# EAGLE design atum-breakout (EAGLE 6.5.0)
AUTHOR: Brad Campbell; REV: A; TITLE: Atum Breakout
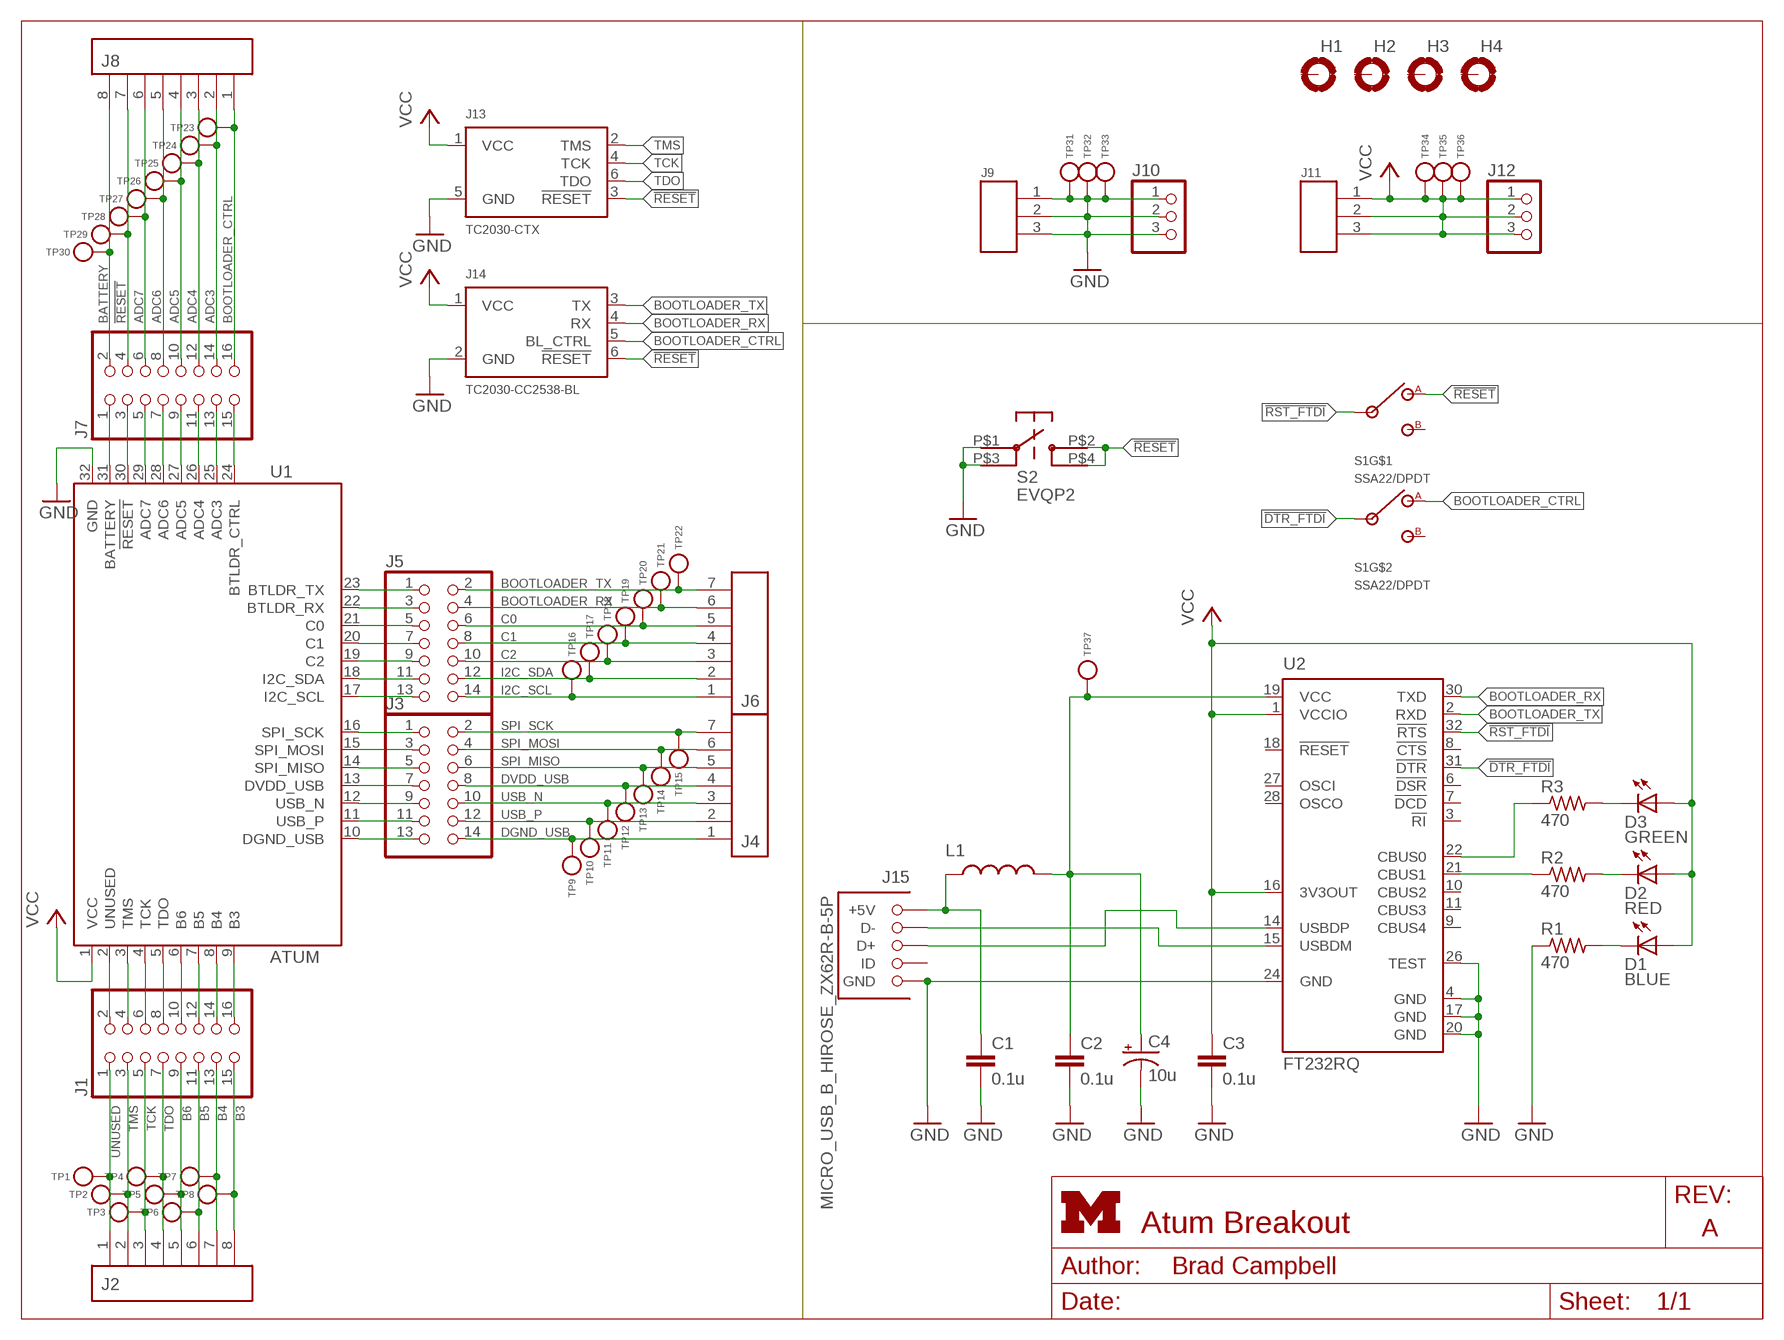
[diagram p0: schematic, sheet 1]
FRAME1 (LETTER_L): HEIGHT: 8.5in; WIDTH: 11in

## Parts
C1  0.1u  C-EUC0603  [C0603]
C2  0.1u  C-EUC0603  [C0603]
C3  0.1u  C-EUC0603  [C0603]
C4  10u  CAP_POL1206  [EIA3216]
D1  BLUE  LED0603  [LED-0603]
D2  RED  LED0603  [LED-0603]
D3  GREEN  LED0603  [LED-0603]
H1  MOUNT-PAD-ROUND3.2  [3,2-PAD]
H2  MOUNT-PAD-ROUND3.2  [3,2-PAD]
H3  MOUNT-PAD-ROUND3.2  [3,2-PAD]
H4  MOUNT-PAD-ROUND3.2  [3,2-PAD]
J1  PINHD-2X8  [2X08]
J2  SCREW-TERMINAL_8_0.100  [CONN_BLOCK_8]
J3  PINHD-2X7  [2X07]
J4  SCREW-TERMINAL_7_0.100  [CONN_BLOCK_7]
J5  PINHD-2X7  [2X07]
J6  SCREW-TERMINAL_7_0.100  [CONN_BLOCK_7]
J7  PINHD-2X8  [2X08]
J8  SCREW-TERMINAL_8_0.100  [CONN_BLOCK_8]
J9  SCREW-TERMINAL_3_0.100  [CONN_BLOCK_3]
J10  PINHD-1X3  [1X03]
J11  SCREW-TERMINAL_3_0.100  [CONN_BLOCK_3]
J12  PINHD-1X3  [1X03]
J13  TC2030-CTX  [TC2030-IDC]
J14  TC2030-CC2538-BL  [TC2030-IDC]
J15  MICRO_USB_B_HIROSE_ZX62R-B-5P  [USB_MICRO_B-HIROSE-ZX62R-B-5P]
L1  INDUCTOR0603  [0603]
R1  470  R-US_R0603  [R0603]
R2  470  R-US_R0603  [R0603]
R3  470  R-US_R0603  [R0603]
S1  SSA22/DPDT  [SSA22/DPDT]
S2  EVQP2  [EVQP2]
TP1  TEST_POINT_0.040IN  [TESTPOINT_0.040IN]
TP2  TEST_POINT_0.040IN  [TESTPOINT_0.040IN]
TP3  TEST_POINT_0.040IN  [TESTPOINT_0.040IN]
TP4  TEST_POINT_0.040IN  [TESTPOINT_0.040IN]
TP5  TEST_POINT_0.040IN  [TESTPOINT_0.040IN]
TP6  TEST_POINT_0.040IN  [TESTPOINT_0.040IN]
TP7  TEST_POINT_0.040IN  [TESTPOINT_0.040IN]
TP8  TEST_POINT_0.040IN  [TESTPOINT_0.040IN]
TP9  TEST_POINT_0.040IN  [TESTPOINT_0.040IN]
TP10  TEST_POINT_0.040IN  [TESTPOINT_0.040IN]
TP11  TEST_POINT_0.040IN  [TESTPOINT_0.040IN]
TP12  TEST_POINT_0.040IN  [TESTPOINT_0.040IN]
TP13  TEST_POINT_0.040IN  [TESTPOINT_0.040IN]
TP14  TEST_POINT_0.040IN  [TESTPOINT_0.040IN]
TP15  TEST_POINT_0.040IN  [TESTPOINT_0.040IN]
TP16  TEST_POINT_0.040IN  [TESTPOINT_0.040IN]
TP17  TEST_POINT_0.040IN  [TESTPOINT_0.040IN]
TP18  TEST_POINT_0.040IN  [TESTPOINT_0.040IN]
TP19  TEST_POINT_0.040IN  [TESTPOINT_0.040IN]
TP20  TEST_POINT_0.040IN  [TESTPOINT_0.040IN]
TP21  TEST_POINT_0.040IN  [TESTPOINT_0.040IN]
TP22  TEST_POINT_0.040IN  [TESTPOINT_0.040IN]
TP23  TEST_POINT_0.040IN  [TESTPOINT_0.040IN]
TP24  TEST_POINT_0.040IN  [TESTPOINT_0.040IN]
TP25  TEST_POINT_0.040IN  [TESTPOINT_0.040IN]
TP26  TEST_POINT_0.040IN  [TESTPOINT_0.040IN]
TP27  TEST_POINT_0.040IN  [TESTPOINT_0.040IN]
TP28  TEST_POINT_0.040IN  [TESTPOINT_0.040IN]
TP29  TEST_POINT_0.040IN  [TESTPOINT_0.040IN]
TP30  TEST_POINT_0.040IN  [TESTPOINT_0.040IN]
TP31  TEST_POINT_0.040IN  [TESTPOINT_0.040IN]
TP32  TEST_POINT_0.040IN  [TESTPOINT_0.040IN]
TP33  TEST_POINT_0.040IN  [TESTPOINT_0.040IN]
TP34  TEST_POINT_0.040IN  [TESTPOINT_0.040IN]
TP35  TEST_POINT_0.040IN  [TESTPOINT_0.040IN]
TP36  TEST_POINT_0.040IN  [TESTPOINT_0.040IN]
TP37  TEST_POINT_0.040IN  [TESTPOINT_0.040IN]
U1  ATUM  [ATUM]
U2  FT232RQ  [QFN32]

## Nets
!DTR_FTDI: S1.COM2 U2.31(!DTR)
!RESET: J7.3 J7.4 J8.7 J13.3(!RESET) J14.6(!RESET) S1.A1 S2.P$2 S2.P$4 TP29.TESTPOINT U1.30(!RESET)
!RST_FTDI: S1.COM1 U2.32(!RTS)
ADC3: J7.13 J7.14 J8.2 TP24.TESTPOINT U1.25(ADC3)
ADC4: J7.11 J7.12 J8.3 TP25.TESTPOINT U1.26(ADC4)
ADC5: J7.9 J7.10 J8.4 TP26.TESTPOINT U1.27(ADC5)
ADC6: J7.7 J7.8 J8.5 TP27.TESTPOINT U1.28(ADC6)
ADC7: J7.5 J7.6 J8.6 TP28.TESTPOINT U1.29(ADC7)
B3: J1.15 J1.16 J2.8 TP8.TESTPOINT U1.9(B3)
B4: J1.13 J1.14 J2.7 TP7.TESTPOINT U1.8(B4)
B5: J1.11 J1.12 J2.6 TP6.TESTPOINT U1.7(B5)
B6: J1.9 J1.10 J2.5 TP5.TESTPOINT U1.6(B6)
BATTERY: J7.1 J7.2 J8.8 TP30.TESTPOINT U1.31(BATTERY)
BOOTLOADER_CTRL: J7.15 J7.16 J8.1 J14.5(BL_CTRL) S1.A2 TP23.TESTPOINT U1.24(BTLDR_CTRL)
BOOTLOADER_RX: J5.3 J5.4 J6.6 J14.4(RX) TP21.TESTPOINT U1.22(BTLDR_RX) U2.30(TXD)
BOOTLOADER_TX: J5.1 J5.2 J6.7 J14.3(TX) TP22.TESTPOINT U1.23(BTLDR_TX) U2.2(RXD)
C0: J5.5 J5.6 J6.5 TP20.TESTPOINT U1.21(C0)
C1: J5.7 J5.8 J6.4 TP19.TESTPOINT U1.20(C1)
C2: J5.9 J5.10 J6.3 TP18.TESTPOINT U1.19(C2)
DGND_USB: J3.13 J3.14 J4.1 TP9.TESTPOINT U1.10(DGND_USB)
DVDD_USB: J3.7 J3.8 J4.4 TP12.TESTPOINT U1.13(DVDD_USB)
GND: C1.2 C2.2 C3.2 C4.C(-) J9.1 J9.2 J9.3 J10.1 J10.2 J10.3 J13.5(GND) J14.2(GND) J15.5(GND) R1.1 S2.P$1 S2.P$3 TP31.TESTPOINT TP32.TESTPOINT TP33.TESTPOINT U1.32(GND) U2.4(GND) U2.17(GND) U2.20(GND) U2.24(GND) U2.26(TEST)
I2C_SCL: J5.13 J5.14 J6.1 TP16.TESTPOINT U1.17(I2C_SCL)
I2C_SDA: J5.11 J5.12 J6.2 TP17.TESTPOINT U1.18(I2C_SDA)
N$1: R3.1 U2.22(CBUS0)
N$2: D2.C R2.2
N$3: J15.2(D-) U2.15(USBDM)
N$4: J15.3(D+) U2.14(USBDP)
N$5: R2.1 U2.21(CBUS1)
N$6: C2.1 C4.A(+) L1.2 TP37.TESTPOINT U2.19(VCC)
N$7: D3.C R3.2
N$8: D1.C R1.2
SPI_MISO: J3.5 J3.6 J4.5 TP13.TESTPOINT U1.14(SPI_MISO)
SPI_MOSI: J3.3 J3.4 J4.6 TP14.TESTPOINT U1.15(SPI_MOSI)
SPI_SCK: J3.1 J3.2 J4.7 TP15.TESTPOINT U1.16(SPI_SCK)
TCK: J1.5 J1.6 J2.3 J13.4(TCK) TP3.TESTPOINT U1.4(TCK)
TDO: J1.7 J1.8 J2.4 J13.6(TDO) TP4.TESTPOINT U1.5(TDO)
TMS: J1.3 J1.4 J2.2 J13.2(TMS) TP2.TESTPOINT U1.3(TMS)
UNUSED: J1.1 J1.2 J2.1 TP1.TESTPOINT U1.2(UNUSED)
USB5V: C1.1 J15.1(+5V) L1.1
USB_N: J3.9 J3.10 J4.3 TP11.TESTPOINT U1.12(USB_N)
USB_P: J3.11 J3.12 J4.2 TP10.TESTPOINT U1.11(USB_P)
VCC: C3.1 D1.A D2.A D3.A J11.1 J11.2 J11.3 J12.1 J12.2 J12.3 J13.1(VCC) J14.1(VCC) TP34.TESTPOINT TP35.TESTPOINT TP36.TESTPOINT U1.1(VCC) U2.1(VCCIO) U2.16(3V3OUT)
Unconnected: H1.B3,2(MOUNT) H2.B3,2(MOUNT) H3.B3,2(MOUNT) H4.B3,2(MOUNT) J15.4(ID) S1.B1 S1.B2 U2.3(!RI) U2.6(!DSR) U2.7(!DCD) U2.8(!CTS) U2.9(CBUS4) U2.10(CBUS2) U2.11(CBUS3) U2.18(!RESET) U2.27(OSCI) U2.28(OSCO)

## Library data of the parts
C1-C3 = rcl:C-EU: CAPACITOR, European symbol; DIGIKEY: 445-1316-1-ND
C4 = SparkFun:CAP_POL: Capacitor Polarized These are standard SMD and PTH capacitors. Normally 10uF, 47uF, and 100uF in electrolytic and tantalum varieties. Always verify the external diameter of the through hole cap, it varies with capacity, voltage, and manufacturer. The EIA devices should be standard.; DIGIKEY: 478-1655-1-ND
D1-D3 = SparkFun:LED: LEDs Standard schematic elements and footprints for 5mm, 3mm, 1206, and 0603 sized LEDs. 5mm - Spark Fun Electronics SKU : COM-00529 (and others)
H1-H4 = holes:MOUNT-PAD-ROUND: MOUNTING PAD, round
J1 J7 = pinhead:PINHD-2X8: PIN HEADER; DIGIKEY: 609-3364-ND; MOUSER: 649-68602-116HLF; NEWARK: 20M2833
J2 J8 = headers:SCREW-TERMINAL_8_0.100: 8x 0.100 in screw terminal block; DIGIKEY: 277-1279-ND
J3 J5 = pinhead:PINHD-2X7: PIN HEADER; DIGIKEY: 609-3491-ND; MOUSER: 649-67996-114HLF; NEWARK: 30M1973
J4 J6 = headers:SCREW-TERMINAL_7_0.100: 7x 0.100 in screw terminal block; DIGIKEY: 277-1278-ND
J9 J11 = headers:SCREW-TERMINAL_3_0.100: 3x 0.100 in screw terminal block; DIGIKEY: 277-1274-ND
J10 J12 = pinhead:PINHD-1X3: PIN HEADER
J13 = connector:TC2030-CTX: Tag Connect footprint for ARM JTAG. 10 pin ARM Cortex Debug Connector.
J14 = connector:TC2030-CC2538-BL: Tag connect programmer for the CC2538 bootloader. The RX/TX switch happens on the programmer board, so when using this connect the TX pin to the TX pin on the CC2538 and same for the RX.
J15 = connector:MICRO_USB_B_HIROSE_ZX62R-B-5P: USB Micro B Connector Rounded side is up.; DIGIKEY: H11574CT-ND; MOUSER: 798-ZX62R-B-5P; NEWARK: 69W0714
L1 = SparkFun:INDUCTOR: Inductors Basic Inductor/Choke - 0603 and 1206. Footprints are not proven and vary greatly between part numbers.; DIGIKEY: 240-2373-1-ND
R1-R3 = rcl:R-US_: RESISTOR, American symbol
S1 = switches:SSA22/DPDT: SW SLIDE DPDT 2POS SSA SER 30V; DIGIKEY: 450-1604-ND; MOUSER: 506-SSA22; NEWARK: 50F5561
S2 = berkeley-epic:EVQP2; DIGIKEY: P11084SCT-ND; MOUSER: 667-EVQ-P2K02Q
TP1-TP37 = headers:TEST_POINT_0.040IN: 0.040in Test Point; DIGIKEY: 5001K-ND
U1 = atum:ATUM: Atum sensorboard prototyping module.
U2 = ftdichip:FT232R: Source: http://www.ftdichip.com/Documents/DataSheets/DS_FT232R_v104.pdf; DIGIKEY: 768-1008-1-ND; MPN: FT232RQ; OC_FARNELL: 1146033; OC_NEWARK: 91K9919

## Board
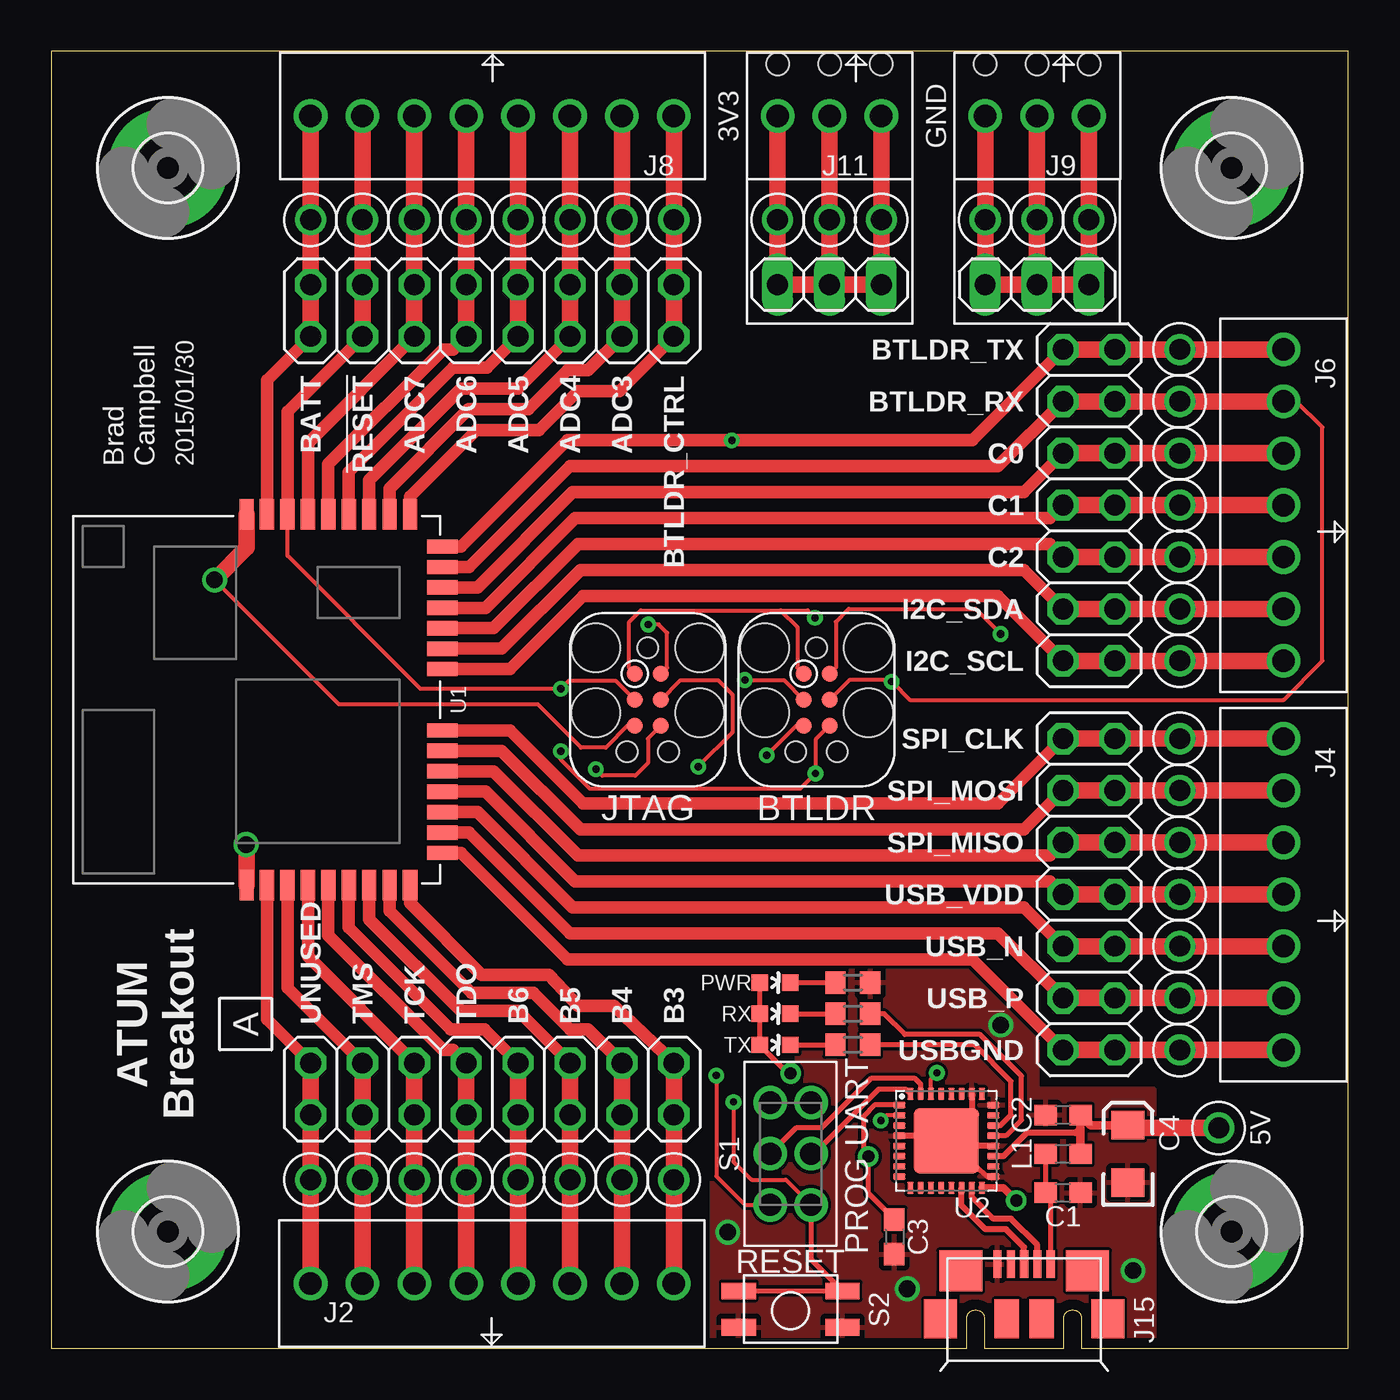
[diagram p1: board, top side]
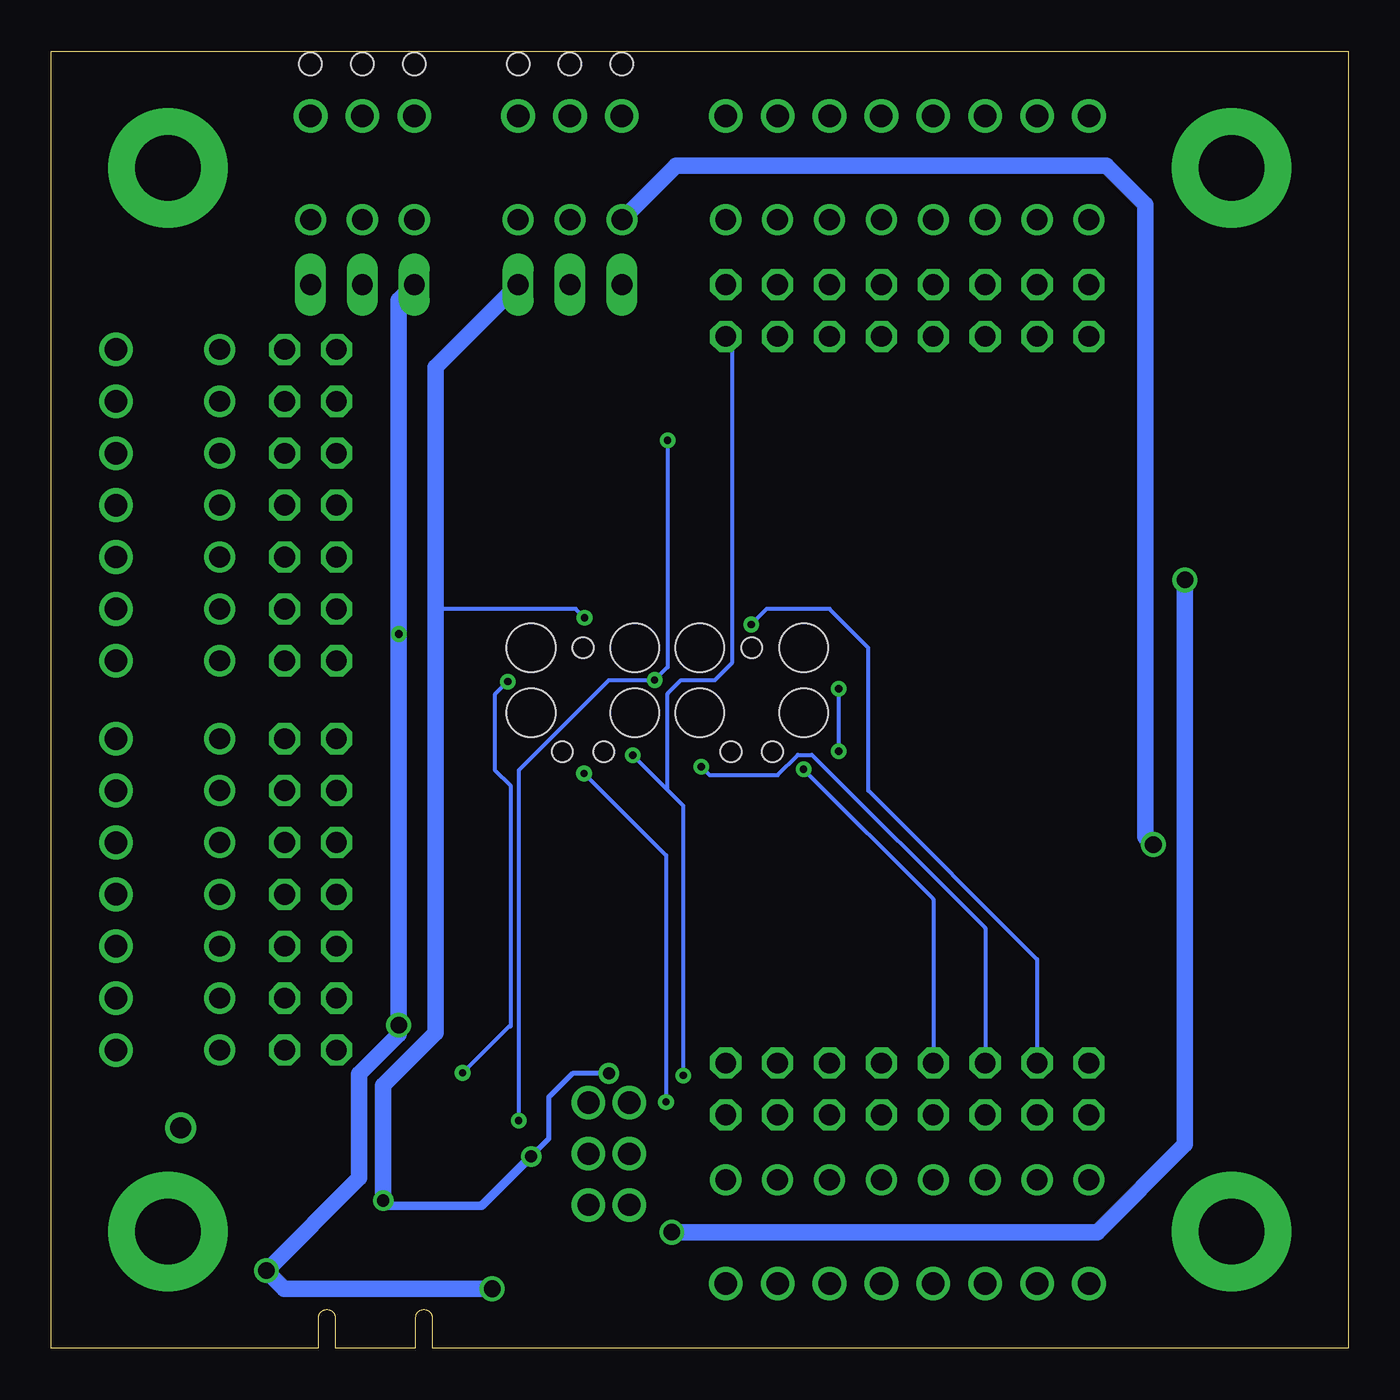
[diagram p2: board, bottom side, seen from below]

Size 63.5 x 63.5 mm. Coordinates in mm from the lower left corner, seen from the top.
Outline: 52.7,0 63.5,0 63.5,63.5 0,63.5 0,0 42.55,0
Copper layers (1*16): Top 0.0178mm / dielectric 59mil / Bottom 0.0178mm
Design rules "sunstone-2lyr_v1.0.0.3 *": minimum track width 6mil, minimum drill 14mil, track to track 6mil, track to pad 6mil, pad to pad 6mil, via to via 6mil, smd to smd 6mil, copper to edge 20mil, drill to drill 16mil, minimum pad ring 8mil, minimum via ring 8mil, stop-mask expansion 3mil, vias tented up to drill 40mil, thermal gap 10mil

### Footprints (pad centres in the part's own frame; a part is rotated, then mirrored left to right if it is on the bottom)
C0603 = smd 1.1 x 1: 1 -0.85,0; 2 0.85,0
EIA3216 = smd 1.4 x 1.6: A 1.4,0; C -1.4,0
LED-0603 = smd 0.8 x 0.8: A 0,-0.75; C 0,0.75
3,2-PAD = drill 3.2 pad 5.842: B3,2 0,0
2X08 = drill 1.016 octagon: 1 -8.89,-1.27; 2 -8.89,1.27; 3 -6.35,-1.27; 4 -6.35,1.27; 5 -3.81,-1.27; 6 -3.81,1.27; 7 -1.27,-1.27; 8 -1.27,1.27; 9 1.27,-1.27; 10 1.27,1.27; 11 3.81,-1.27; 12 3.81,1.27; 13 6.35,-1.27; 14 6.35,1.27; 15 8.89,-1.27; 16 8.89,1.27
CONN_BLOCK_8 = drill 1.1: 1 -8.89,0; 2 -6.35,0; 3 -3.81,0; 4 -1.27,0; 5 1.27,0; 6 3.81,0; 7 6.35,0; 8 8.89,0
2X07 = drill 1.016 octagon: 1 -7.62,-1.27; 2 -7.62,1.27; 3 -5.08,-1.27; 4 -5.08,1.27; 5 -2.54,-1.27; 6 -2.54,1.27; 7 0,-1.27; 8 0,1.27; 9 2.54,-1.27; 10 2.54,1.27; 11 5.08,-1.27; 12 5.08,1.27; 13 7.62,-1.27; 14 7.62,1.27
CONN_BLOCK_7 = drill 1.1: 1 -7.62,0; 2 -5.08,0; 3 -2.54,0; 4 0,0; 5 2.54,0; 6 5.08,0; 7 7.62,0
CONN_BLOCK_3 = drill 1.1: 1 -2.54,0; 2 0,0; 3 2.54,0 | hole 1.1: -2.54,-2.54; 0,-2.54; 2.54,-2.54
1X03 = drill 1.016 long: 1 -2.54,0; 2 0,0; 3 2.54,0
TC2030-IDC = smd 0.787 x 0.787: 1 -1.27,-0.635; 2 -1.27,0.635; 3 0,-0.635; 4 0,0.635; 5 1.27,-0.635; 6 1.27,0.635 | hole 2.375: -2.54,2.54; 0.635,2.54; 0.635,-2.54; -2.54,-2.54 | hole 1.016: -2.54,0; 2.54,1.016; 2.54,-1.016
USB_MICRO_B-HIROSE-ZX62R-B-5P = smd 0.4 x 1.35: 1 1.3,4.125; 2 0.65,4.125; 3 0,4.125; 4 -0.65,4.125; 5 -1.3,4.125 | smd 2.1 x 2: P$1 3.1,3.8; P$2 -3.1,3.8 | smd 1.6 x 1.9: P$3 -4.1,1.45; P$6 4.1,1.45 | smd 1.2 x 1.9: P$4 -0.85,1.45; P$5 0.85,1.45
0603 = smd 1.1 x 1: 1 -0.85,0; 2 0.85,0
R0603 = smd 1 x 1.1: 1 -0.85,0; 2 0.85,0
SSA22/DPDT = drill 1.092: A1 2.5,1; A2 2.5,-1; B1 -2.5,1; B2 -2.5,-1; COM1 0,1; COM2 0,-1
EVQP2 = smd 1.676 x 0.813: P$1 -2.54,-0.87; P$2 -2.54,0.908; P$3 2.54,-0.87; P$4 2.54,0.908
TESTPOINT_0.040IN = drill 1.016: TESTPOINT 0,0
ATUM = smd 0.7 x 1.5: 1 -9.479,-9.079; 2 -8.479,-9.079; 3 -7.479,-9.079; 4 -6.479,-9.079; 5 -5.479,-9.079; 6 -4.479,-9.079; 7 -3.479,-9.079; 8 -2.479,-9.079; 24 -1.479,9.079; 25 -2.479,9.079; 26 -3.479,9.079; 27 -4.479,9.079; 28 -5.479,9.079; 29 -6.479,9.079; 30 -7.479,9.079; 31 -8.479,9.079; 32 -9.479,9.079 | smd 0.754 x 1.5: 9 -1.479,-9.079 | smd 1.5 x 0.7: 10 0.1,-7.5; 11 0.1,-6.5; 12 0.1,-5.5; 13 0.1,-4.5; 14 0.1,-3.5; 15 0.1,-2.5; 16 0.1,-1.5; 17 0.1,1.5; 18 0.1,2.5; 19 0.1,3.5; 20 0.1,4.5; 21 0.1,5.5; 22 0.1,6.5; 23 0.1,7.5
QFN32 = smd 0.6 x 0.3: 1 -2.3,1.75; 2 -2.3,1.25; 3 -2.3,0.75; 4 -2.3,0.25; 5 -2.3,-0.25; 6 -2.3,-0.75; 7 -2.3,-1.25; 8 -2.3,-1.75; 17 2.3,-1.75; 18 2.3,-1.25; 19 2.3,-0.75; 20 2.3,-0.25; 21 2.3,0.25; 22 2.3,0.75; 23 2.3,1.25; 24 2.3,1.75 | smd 0.3 x 0.6: 9 -1.75,-2.3; 10 -1.25,-2.3; 11 -0.75,-2.3; 12 -0.25,-2.3; 13 0.25,-2.3; 14 0.75,-2.3; 15 1.25,-2.3; 16 1.75,-2.3; 25 1.75,2.3; 26 1.25,2.3; 27 0.75,2.3; 28 0.25,2.3; 29 -0.25,2.3; 30 -0.75,2.3; 31 -1.25,2.3; 32 -1.75,2.3 | smd 3.2 x 3.2: EXP 0,0

### Placement (x,y rotation side)
C1  49.53,7.62 0 top
C2  49.53,11.43 180 top
C3  41.27,5.46 270 top
C4  52.7,9.53 90 top
D1  35.43,17.91 270 top
D2  35.43,16.38 270 top
D3  35.43,14.86 270 top
H1  57.78,5.71 0 top
H2  5.71,5.71 0 top
H3  57.78,57.78 0 top
H4  5.71,57.78 0 top
J1  21.59,12.7 0 top
J2  21.59,3.17 0 top
J3  50.8,22.23 270 top
J4  60.33,22.23 90 top
J5  50.8,41.27 270 top
J6  60.33,41.27 90 top
J7  21.59,50.8 0 top
J8  21.59,60.33 180 top
J9  48.26,60.33 180 top
J10  48.26,52.07 0 top
J11  38.1,60.33 180 top
J12  38.1,52.07 0 top
J13  29.21,31.75 270 top
J14  37.47,31.75 270 top
J15  47.62,0 0 top
L1  49.53,9.53 0 top
R1  39.24,17.91 180 top
R2  39.24,16.38 180 top
R3  39.24,14.86 180 top
S1  36.2,9.53 270 top
S2  36.2,1.91 0 top
TP1  12.7,8.26 0 top
TP2  15.24,8.26 0 top
TP3  17.78,8.26 0 top
TP4  20.32,8.26 0 top
TP5  22.86,8.26 0 top
TP6  25.4,8.26 0 top
TP7  27.94,8.26 0 top
TP8  30.48,8.26 0 top
TP9  55.24,14.61 0 top
TP10  55.24,17.14 0 top
TP11  55.24,19.68 0 top
TP12  55.24,22.23 0 top
TP13  55.24,24.77 0 top
TP14  55.24,27.3 0 top
TP15  55.24,29.84 0 top
TP16  55.24,33.66 0 top
TP17  55.24,36.2 0 top
TP18  55.24,38.73 0 top
TP19  55.24,41.27 0 top
TP20  55.24,43.81 0 top
TP21  55.24,46.35 0 top
TP22  55.24,48.9 0 top
TP23  30.48,55.24 0 top
TP24  27.94,55.24 0 top
TP25  25.4,55.24 0 top
TP26  22.86,55.24 0 top
TP27  20.32,55.24 0 top
TP28  17.78,55.24 0 top
TP29  15.24,55.24 0 top
TP30  12.7,55.24 0 top
TP31  50.8,55.24 0 top
TP32  48.26,55.24 0 top
TP33  45.72,55.24 0 top
TP34  40.64,55.24 0 top
TP35  38.1,55.24 0 top
TP36  35.56,55.24 0 top
TP37  57.15,10.79 0 top
U1  19.05,31.75 0 top
U2  43.81,10.16 0 top

### Tracks (layer width: path | path; a pad name or v marks a point on that pad's centre or on a via)
!DTR_FTDI
  Top 0.254: U2.31 42.56,12.93 42.29,13.21 40.13,13.21 37.72,10.79 36.47,10.79 S1.COM2
!RESET  (via drill 0.36)
  Top 0.203: J13.3 27.66,32.66 25.32,32.66 v24.94,32.28 18.09,32.28 11.57,38.8 U1.30 | J14.6 37.41,29.79 v37.41,28.14 36.68,27.41 26.36,27.41 24.94,28.83 v24.94,29.23 | v33.4,12.06 33.4,9.14 34.29,8.26 35.97,8.26 S1.A1
  Top 0.254: S2.P$2 S2.P$4 37.2,4.35 S1.A1
  Top 0.61: U1.30 11.57,45.86 J7.3
  Top 0.813: J7.3 J7.4 TP29.TESTPOINT J8.7
  Bottom 0.203: v37.41,28.14 33.4,24.13 v33.4,12.06 | v24.94,29.23 v24.94,32.28
!RST_FTDI
  Top 0.254: S1.COM1 37.34,9.53 40.51,12.7 41.83,12.7 U2.32
ADC3
  Top 0.61: U1.25 16.57,42.1 20.45,45.97 23.37,45.97 25.27,47.88 26.29,47.88 J7.13
  Top 0.813: J8.2 TP24.TESTPOINT J7.14 J7.13
ADC4
  Top 0.61: U1.26 15.57,42.49 20.07,46.99 22.86,46.99 J7.11
  Top 0.813: J7.11 J7.12 TP25.TESTPOINT J8.3
ADC5
  Top 0.61: U1.27 14.57,42.89 19.68,48.01 21.34,48.01 J7.9
  Top 0.813: J8.4 TP26.TESTPOINT J7.10 J7.9
ADC6
  Top 0.61: U1.28 13.57,43.29 19.18,48.9 19.68,48.9 J7.7
  Top 0.813: J7.7 J7.8 TP27.TESTPOINT J8.5
ADC7
  Top 0.61: U1.29 12.57,44.32 J7.5
  Top 0.813: J8.6 TP28.TESTPOINT J7.6 J7.5
B3
  Top 0.61: U1.9 17.57,21.8 21.08,18.29 24.38,18.29 25.78,16.76 27.56,16.76 J1.16
  Top 0.813: J2.8 TP8.TESTPOINT J1.15 J1.16
B4
  Top 0.61: U1.8 16.57,21.4 20.57,17.4 23.62,17.4 25.4,15.62 26.29,15.62 J1.14
  Top 0.813: J1.14 J1.13 TP7.TESTPOINT J2.7
B5
  Top 0.61: U1.7 15.57,21 20.07,16.51 22.86,16.51 J1.12
  Top 0.813: J2.6 TP6.TESTPOINT J1.11 J1.12
B6
  Top 0.61: U1.6 14.57,20.61 19.56,15.62 21.21,15.62 J1.10
  Top 0.813: J1.10 J1.9 TP5.TESTPOINT J2.5
BATTERY
  Top 0.61: U1.31 10.57,47.4 J7.1
  Top 0.813: J8.8 TP30.TESTPOINT J7.2 J7.1
BOOTLOADER_CTRL  (via drill 0.36)
  Top 0.203: J14.5 36.47,30.48 v35.03,29.03 | v32.56,13.36 32.56,8.43 33.97,7.03 S1.A2
  Top 0.61: U1.24 17.57,41.7 20.83,44.96 23.88,44.96 25.78,46.86 27.81,46.86 J7.15
  Top 0.813: J7.15 J7.16 TP23.TESTPOINT J8.1
  Bottom 0.203: v35.03,29.03 33.33,27.33 | 33.33,27.33 32.56,26.57 v32.56,13.36 | 33.33,27.33 33.33,32.05 32.66,32.72 31.01,32.72 30.15,33.58 30.15,49.2 J7.15
BOOTLOADER_RX  (via drill 0.36)
  Top 0.203: U2.30 43.06,13.2 v43.36,13.49 | J14.4 39.06,32.72 41.07,32.72 v41.15,32.64 42.04,31.75 60.33,31.75 62.23,33.66 62.23,45.09 60.96,46.35 J6.6
  Top 0.61: U1.22 20.47,38.25 25.4,43.18 46.35,43.18 J5.3
  Top 0.813: J5.3 J5.4 TP21.TESTPOINT J6.6
  Bottom 0.203: v41.15,32.64 41.78,32 41.78,28.32 41.02,27.56 41.02,15.75 41.1,15.75 v43.36,13.49
BOOTLOADER_TX  (via drill 0.36)
  Top 0.203: U2.2 40.9,11.41 v40.62,11.15 | v33.96,32.72 35.87,32.72 J14.3
  Top 0.61: U1.23 20.07,39.25 25.27,44.45 v33.33,44.45 45.09,44.45 J5.1
  Top 0.813: J6.7 TP22.TESTPOINT J5.2 J5.1
  Bottom 0.203: v40.62,11.15 40.62,28.3 36.2,32.72 v33.96,32.72 33.33,33.35 v33.33,44.45
C0
  Top 0.61: U1.21 20.87,37.25 25.53,41.91 47.62,41.91 J5.5
  Top 0.813: J6.5 TP20.TESTPOINT J5.6 J5.5
C1
  Top 0.61: U1.20 21.26,36.25 25.65,40.64 48.9,40.64 J5.7
  Top 0.813: J5.7 J5.8 TP19.TESTPOINT J6.4
C2
  Top 0.61: U1.19 21.66,35.25 25.78,39.37 48.9,39.37 J5.9
  Top 0.813: J5.9 J5.10 TP18.TESTPOINT J6.3
DGND_USB
  Top 0.61: U1.10 20.07,24.25 25.27,19.05 45.09,19.05 J3.13
  Top 0.813: J3.13 J3.14 TP9.TESTPOINT J4.1
DVDD_USB
  Top 0.61: U1.13 21.26,27.25 25.65,22.86 48.9,22.86 J3.7
  Top 0.813: J3.7 J3.8 TP12.TESTPOINT J4.4
GND  (via drill 0.36, 0.81)
  Top 0.203: J13.5 28.22,30.48 27.15,29.41 25.93,29.41 23.82,31.52 14.1,31.52 v8,37.62 | J14.2 38.41,33.33 38.41,35.56 39.04,36.2 45.26,36.2 v46.48,34.98
  Top 0.254: U2.17 45.82,8.41 45.47,8.71 44.96,9.22 44.96,9.78
  Top 0.305: U2.26 45.06,11.66 43.81,10.41 | 43.81,10.41 U2.4 | U2.20 45.09,9.91 | 45.09,9.91 44.31,9.91 43.81,10.41 | 44.96,9.78 45.09,9.91
  Top 0.813: J9.3 TP33.TESTPOINT J10.1 | J9.2 TP32.TESTPOINT J10.2 J10.1 | J9.1 TP31.TESTPOINT J10.3 J10.1 | v8,37.62 9.57,39.19 U1.32
  Bottom 0.813: J10.1 46.48,51.31 v46.48,34.98 v46.48,34.95 v46.48,15.82 46.48,15.37 48.41,13.44 48.41,8.36 v52.96,3.81 | v8,37.62 8,9.98 12.29,5.69 v33.12,5.69 | v41.91,2.92 52.09,2.92 52.96,3.79
  pour Top: 32.38,0 32.38,20.32 48.26,20.32 48.26,12.7 53.98,12.7 53.98,0
I2C_SCL
  Top 0.61: J5.13 46.35,36.83 26.04,36.83 22.45,33.25 U1.17
  Top 0.813: J5.13 J5.14 TP16.TESTPOINT J6.1
I2C_SDA
  Top 0.61: J5.11 47.62,38.1 25.91,38.1 22.06,34.25 U1.18
  Top 0.813: J6.2 TP17.TESTPOINT J5.12 J5.11
N$1
  Top 0.254: U2.22 46.47,10.91 46.99,11.43 46.99,13.08 45.21,14.86 R3.1
N$2
  Top 0.254: D2.C R2.2
N$3
  Top 0.305: J15.2 48.27,5.07 46.99,6.35 46.1,6.35 45.06,7.39 U2.15
N$4
  Top 0.305: J15.3 47.62,4.95 46.74,5.84 45.72,5.84 44.56,7 U2.14
N$5
  Top 0.254: U2.21 46.73,10.41 47.5,11.18 47.5,13.34 45.47,15.37 41.78,15.37 40.77,16.38 R2.1
N$6
  Top 0.305: U2.19 46.62,9.41 47.75,10.54 50.13,10.54 50.38,10.79
  Top 0.406: C4.A 50.88,10.93 C2.1 50.38,10.79 L1.2
  Top 0.813: TP37.TESTPOINT 52.84,10.79 C4.A
N$7
  Top 0.254: D3.C R3.2
N$8
  Top 0.254: D1.C R1.2
SPI_MISO
  Top 0.61: U1.14 21.66,28.25 25.78,24.13 48.9,24.13 J3.5
  Top 0.813: J4.5 TP13.TESTPOINT J3.6 J3.5
SPI_MOSI
  Top 0.61: J3.3 47.62,25.4 25.91,25.4 22.06,29.25 U1.15
  Top 0.813: J3.3 J3.4 TP14.TESTPOINT J4.6
SPI_SCK
  Top 0.61: J3.1 46.35,26.67 26.04,26.67 22.45,30.25 U1.16
  Top 0.813: J4.7 TP15.TESTPOINT J3.2 J3.1
TCK  (via drill 0.36)
  Top 0.203: J13.4 30.81,32.72 32.64,32.72 33.35,32 33.35,30.15 v31.67,28.47
  Top 0.61: U1.4 12.57,19.18 J1.6
  Top 0.813: J1.6 J1.5 TP3.TESTPOINT J2.3
  Bottom 0.203: J1.6 17.78,20.57 26.26,29.06 26.95,29.06 27.94,28.07 31.27,28.07 v31.67,28.47
TDO  (via drill 0.36)
  Top 0.203: J13.6 29.21,29.84 29.21,28.65 28.6,28.04 26.98,28.04 v26.67,28.35
  Top 0.61: U1.5 13.57,20.21 19.18,14.61 19.68,14.61 J1.8
  Top 0.813: J2.4 TP4.TESTPOINT J1.7 J1.8
  Bottom 0.203: J1.8 20.32,22 v26.67,28.35
TMS  (via drill 0.36)
  Top 0.203: J13.2 30.15,33.33 30.15,35.03 29.74,35.43 v29.23,35.43
  Top 0.61: U1.3 11.57,17.64 J1.4
  Top 0.813: J2.2 TP2.TESTPOINT J1.3 J1.4
  Bottom 0.203: J1.4 15.24,19.05 23.5,27.3 23.5,34.29 25.4,36.2 28.47,36.2 v29.23,35.43
UNUSED
  Top 0.61: U1.2 10.57,16.1 J1.2
  Top 0.813: J1.2 J1.1 TP1.TESTPOINT J2.1
USB5V
  Top 0.254: J15.1 48.92,7.38 C1.1 L1.1
USB_N
  Top 0.61: U1.12 20.87,26.25 25.53,21.59 47.62,21.59 J3.9
  Top 0.813: J3.9 J3.10 TP11.TESTPOINT J4.3
USB_P
  Top 0.61: U1.11 20.47,25.25 25.4,20.32 46.35,20.32 J3.11
  Top 0.813: J4.2 TP10.TESTPOINT J3.12 J3.11
VCC  (via drill 0.36, 0.6, 0.81)
  Top 0.203: J13.1 28.3,33.3 28.3,35.56 28.85,36.12 35.71,36.12 | 35.71,36.12 36.52,35.31 36.52,33.33 J14.1 | 35.71,36.12 37.03,36.12 v37.39,35.76
  Top 0.254: D1.A D2.A D3.A 36.08,13.46 v36.2,13.46 | U2.1 40.31,11.91 39.75,11.35 39.75,9.65 v40.01,9.4 40.01,7.58 C3.1
  Top 0.356: U2.16 46.62,7.86 v47.24,7.24
  Top 0.813: J12.1 TP36.TESTPOINT J11.3 | J11.1 TP34.TESTPOINT J12.3 J12.1 | J11.2 TP35.TESTPOINT J12.2 J12.1 | v9.55,24.66 9.57,24.64 U1.1
  Bottom 0.203: v37.39,35.76 37.82,36.2 44.68,36.2
  Bottom 0.254: v36.2,13.46 37.97,13.46 39.14,12.29 39.14,10.26 v40.01,9.4
  Bottom 0.406: v40.01,9.4 42.42,6.99 46.99,6.99 v47.24,7.24
  Bottom 0.813: v47.24,7.24 47.24,12.88 44.68,15.44 44.68,36.2 44.68,48.03 J12.3 | TP36.TESTPOINT 32.92,57.89 11.84,57.89 9.93,55.98 9.93,25.04 v9.55,24.66

### Text on the board
tPlace: 3V3 | GND | BTLDR_TX | BATT | !RESET | ADC7 | ADC6 | ADC5 | ADC4 | ADC3 | BTLDR_CTRL | BTLDR_RX | C0 | Brad / Campbell | 2015/01/30 | C1 | C2 | I2C_SDA | I2C_SCL | SPI_CLK | JTAG | BTLDR | SPI_MOSI | SPI_MISO | USB_VDD | USB_N | PWR | USB_P | ATUM / Breakout | A | UNUSED | TMS | TCK | TDO | B6 | B5 | B4 | B3 | RX | TX | USBGND | UART | 5V | PROG | RESET